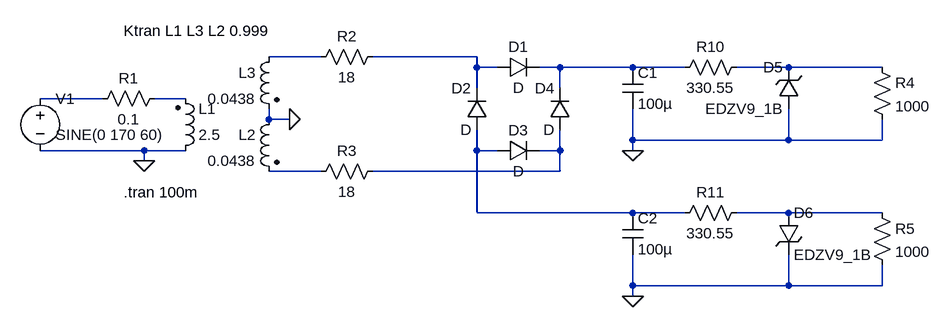
[diagram p0: schematic Draft1.asc]
Draft1.asc, the LTspice schematic file:
Version 4
SHEET 1 964 680
WIRE -160 -464 -240 -464
WIRE 80 -464 -80 -464
WIRE 80 -448 80 -464
WIRE 112 -448 80 -448
WIRE 208 -448 176 -448
WIRE 320 -448 208 -448
WIRE 400 -448 320 -448
WIRE 560 -448 480 -448
WIRE 704 -448 560 -448
WIRE 80 -416 80 -448
WIRE 208 -416 208 -448
WIRE -496 -400 -592 -400
WIRE -368 -400 -416 -400
WIRE -240 -368 -240 -384
WIRE -208 -368 -240 -368
WIRE 320 -336 320 -384
WIRE 560 -336 560 -384
WIRE 560 -336 320 -336
WIRE 704 -336 704 -368
WIRE 704 -336 560 -336
WIRE -432 -320 -592 -320
WIRE -368 -320 -432 -320
WIRE 80 -320 80 -352
WIRE 112 -320 80 -320
WIRE 208 -320 208 -352
WIRE 208 -320 176 -320
WIRE 320 -320 320 -336
WIRE -432 -304 -432 -320
WIRE -160 -288 -240 -288
WIRE 208 -288 208 -320
WIRE 208 -288 -80 -288
WIRE 80 -224 80 -320
WIRE 320 -224 80 -224
WIRE 400 -224 320 -224
WIRE 560 -224 480 -224
WIRE 704 -224 560 -224
WIRE 320 -112 320 -160
WIRE 560 -112 560 -160
WIRE 560 -112 320 -112
WIRE 704 -112 704 -144
WIRE 704 -112 560 -112
WIRE 320 -96 320 -112
FLAG -432 -304 0
FLAG -208 -368 0
FLAG 320 -320 0
FLAG 320 -96 0
DATAFLAG -432 -304 ""
SYMBOL voltage -592 -416 R0
WINDOW 123 24 44 Left 2
WINDOW 39 0 0 Left 0
WINDOW 3 24 72 Left 2
SYMATTR Value SINE(0 170 60)
SYMATTR InstName V1
SYMBOL res -400 -416 R90
WINDOW 0 0 56 VBottom 2
WINDOW 3 32 56 VTop 2
SYMATTR InstName R1
SYMATTR Value 0.1
SYMBOL ind2 -384 -304 M180
WINDOW 0 36 80 Left 2
WINDOW 3 36 40 Left 2
SYMATTR InstName L1
SYMATTR Value 2.5
SYMATTR Type ind
SYMBOL res -64 -480 R90
WINDOW 0 0 56 VBottom 2
WINDOW 3 32 56 VTop 2
SYMATTR InstName R2
SYMATTR Value 18
SYMBOL res -64 -304 R90
WINDOW 0 0 56 VBottom 2
WINDOW 3 32 56 VTop 2
SYMATTR InstName R3
SYMATTR Value 18
SYMBOL ind2 -224 -384 M0
SYMATTR InstName L2
SYMATTR Value 0.0438
SYMATTR Type ind
SYMBOL ind2 -224 -480 M0
SYMATTR InstName L3
SYMATTR Value 0.0438
SYMATTR Type ind
SYMBOL diode 112 -432 R270
WINDOW 0 32 32 VTop 2
WINDOW 3 0 32 VBottom 2
SYMATTR InstName D1
SYMBOL diode 96 -352 R180
WINDOW 0 24 64 Left 2
WINDOW 3 24 0 Left 2
SYMATTR InstName D2
SYMBOL diode 112 -304 R270
WINDOW 0 32 32 VTop 2
WINDOW 3 0 32 VBottom 2
SYMATTR InstName D3
SYMBOL diode 224 -352 R180
WINDOW 0 24 64 Left 2
WINDOW 3 24 0 Left 2
SYMATTR InstName D4
SYMBOL cap 304 -448 R0
SYMATTR InstName C1
SYMATTR Value 100µ
SYMBOL cap 304 -224 R0
SYMATTR InstName C2
SYMATTR Value 100µ
SYMBOL res 688 -464 R0
SYMATTR InstName R4
SYMATTR Value 1000
SYMBOL res 688 -240 R0
SYMATTR InstName R5
SYMATTR Value 1000
SYMBOL zener 576 -384 R180
WINDOW 0 24 64 Left 2
WINDOW 3 24 0 Left 2
SYMATTR InstName D5
SYMATTR Value EDZV9_1B
SYMBOL zener 544 -224 R0
SYMATTR InstName D6
SYMATTR Value EDZV9_1B
SYMBOL res 496 -464 R90
WINDOW 0 0 56 VBottom 2
WINDOW 3 32 56 VTop 2
SYMATTR InstName R10
SYMATTR Value 330.55
SYMBOL res 496 -240 R90
WINDOW 0 0 56 VBottom 2
WINDOW 3 32 56 VTop 2
SYMATTR InstName R11
SYMATTR Value 330.55
TEXT -464 -504 Left 2 !Ktran L1 L3 L2 0.999
TEXT -464 -256 Left 2 !.tran 100m

The netlist it stands for:
* Draft1.asc
V1 N005 0 SINE(0 170 60)
R1 N006 N005 0.1
L1 0 N006 2.5
R2 N002 N001 18
R3 N008 N009 18
L2 0 N009 0.0438
L3 N001 0 0.0438
D1 N002 N003 D
D2 N007 N002 D
D3 N007 N008 D
D4 N008 N003 D
C1 N003 0 100µ
C2 N007 0 100µ
R4 N004 0 1000
R5 N010 0 1000
D5 0 N004 EDZV9_1B
D6 N010 0 EDZV9_1B
R10 N004 N003 330.55
R11 N010 N007 330.55
.model D D
.lib standard.dio
Ktran L1 L3 L2 0.999
.tran 100m
.backanno
.end